# EAGLE schematic emonVS (EAGLE 9.6.2)
AUTHOR: OpenEnergyMonitor; IGNORE_RENUMBER: F;RV; SOURCE: github.com/openenergymonitor/emonVoltageSense; VERSION: 1.3.2
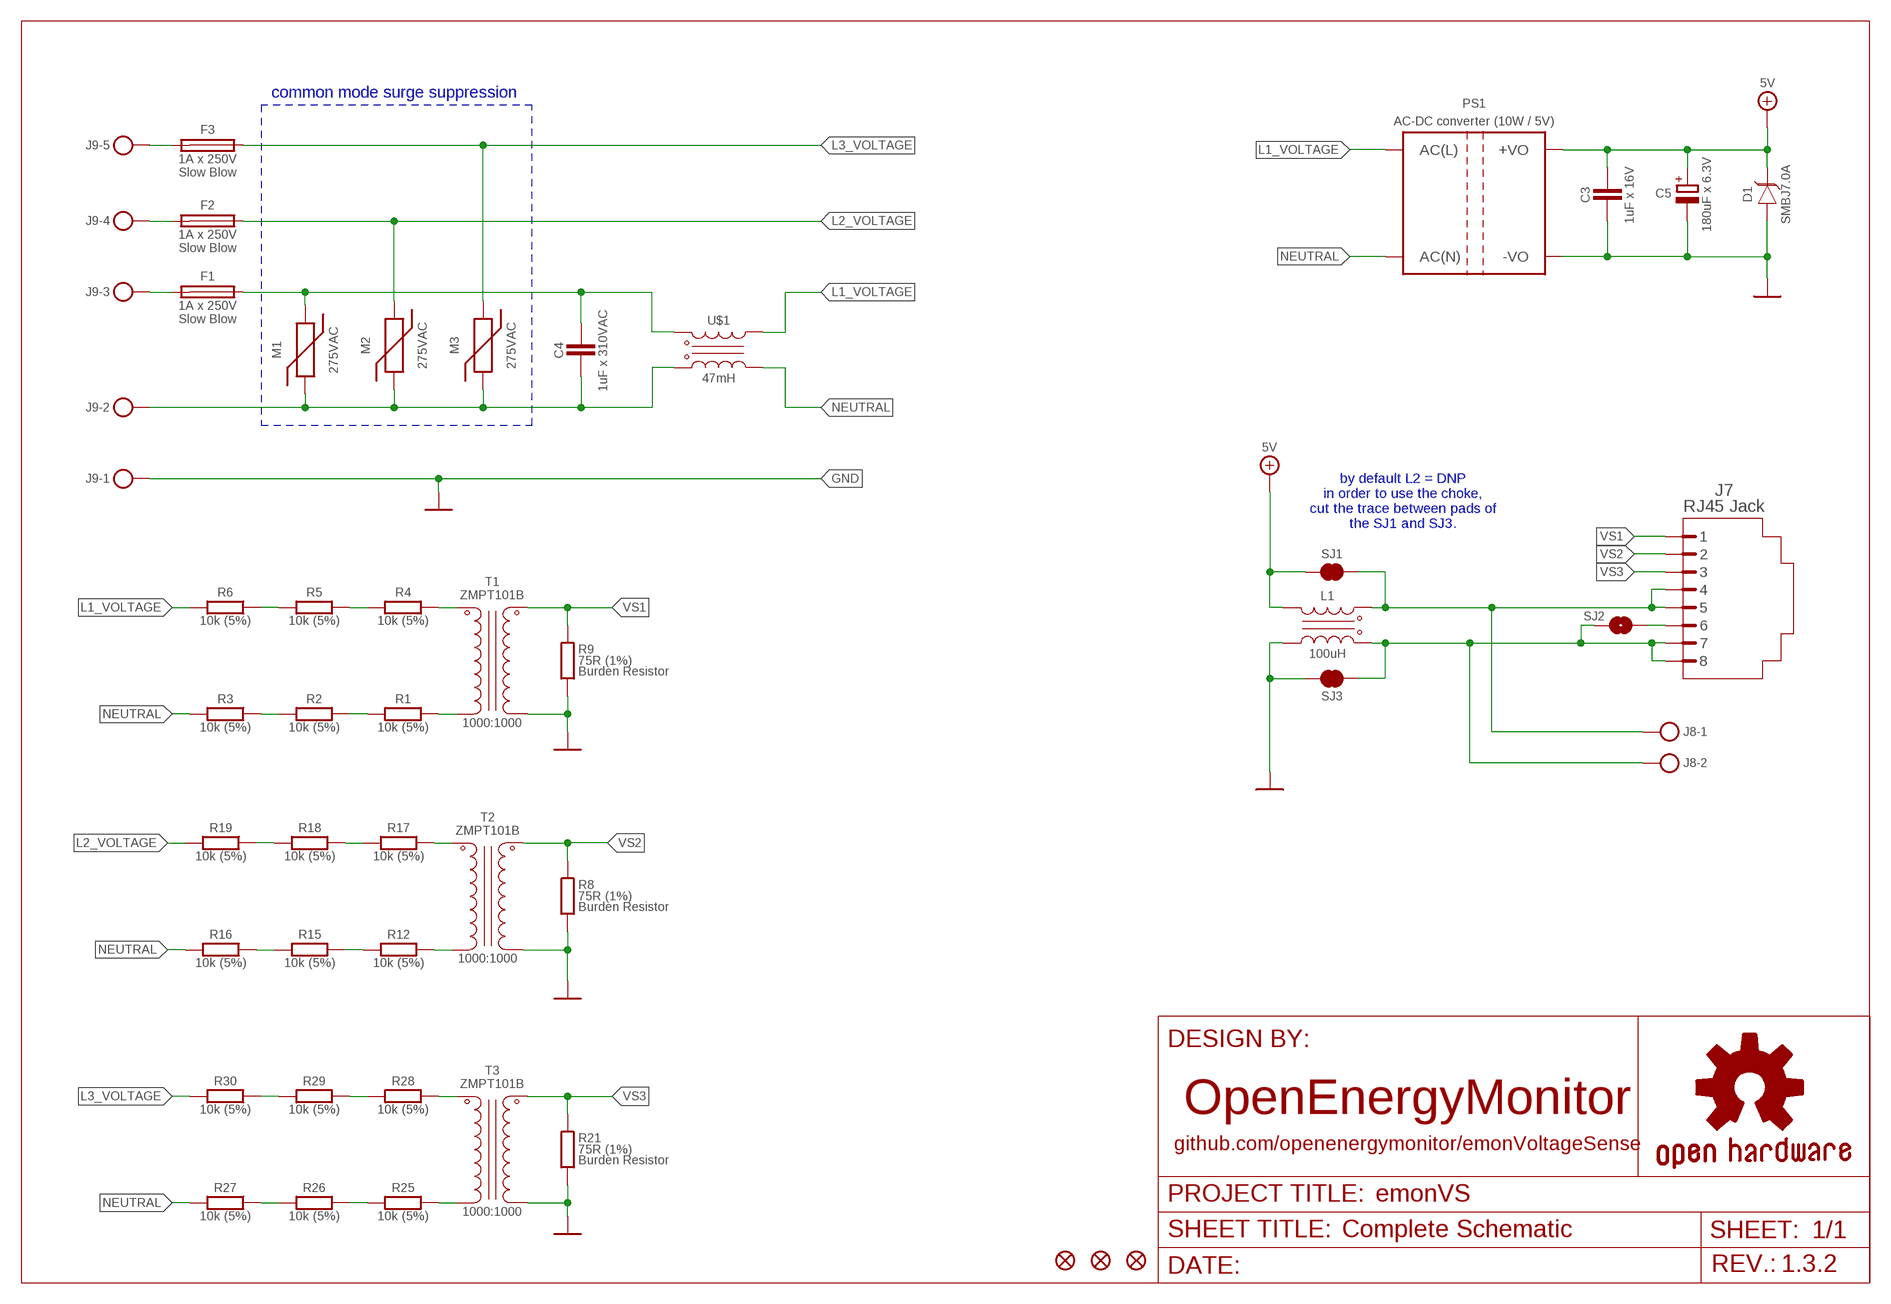
[diagram p0: schematic, sheet 1]

## Parts
C3  1uF x 16V  C_0603  [C0603]
C4  1uF x 310VAC  C_  [C_PTH]
C5  180uF x 6.3V  CP_SV-C  [CSV-C]
D1  TVS  [DO-214AA]
F1  1A x 250V  FUSE  [FUSE]
F2  1A x 250V  FUSE  [FUSE]
F3  1A x 250V  FUSE  [FUSE]
FD1  FIDUCIAL1X2  [FIDUCIAL]
FD2  FIDUCIAL1X2  [FIDUCIAL]
FD3  FIDUCIAL1X2  [FIDUCIAL]
J7  RJ45 Jack  RJ45-8PPTH  [RJ45-8P]
J8  TERMINAL_BLOCK_2P  [TERMINAL_BLOCK_2P]
J9  TERMINAL_BLOCK_5P  [TERMINAL_BLOCK_5P]
L1  100uH  CHOKES-WE-SL3  [CHOKE_WURTH]
M1  275VAC  MOV_14MM_275VAC  [MOV]
M2  275VAC  MOV_14MM_275VAC  [MOV]
M3  275VAC  MOV_14MM_275VAC  [MOV]
PS1  AC-DC converter (10W / 5V)  MULTICOMP-AC/DC  [MULTICOMP-AC/DC]
R1  10k (5%)  R_0603  [R0603]
R2  10k (5%)  R_0603  [R0603]
R3  10k (5%)  R_0603  [R0603]
R4  10k (5%)  R_0603  [R0603]
R5  10k (5%)  R_0603  [R0603]
R6  10k (5%)  R_0603  [R0603]
R8  75R (1%)  R_  [R_PTH_SMD]
R9  75R (1%)  R_  [R_PTH_SMD]
R12  10k (5%)  R_0603  [R0603]
R15  10k (5%)  R_0603  [R0603]
R16  10k (5%)  R_0603  [R0603]
R17  10k (5%)  R_0603  [R0603]
R18  10k (5%)  R_0603  [R0603]
R19  10k (5%)  R_0603  [R0603]
R21  75R (1%)  R_  [R_PTH_SMD]
R25  10k (5%)  R_0603  [R0603]
R26  10k (5%)  R_0603  [R0603]
R27  10k (5%)  R_0603  [R0603]
R28  10k (5%)  R_0603  [R0603]
R29  10k (5%)  R_0603  [R0603]
R30  10k (5%)  R_0603  [R0603]
SJ1  SOLDER_JUMPER_2P_NC  [SJ_2S-NC]
SJ2  SOLDER_JUMPER_2P_NO  [SJ_2S-NO]
SJ3  SOLDER_JUMPER_2P_NC  [SJ_2S-NC]
T1  ZMPT101B  [ZMPT101B]
T2  ZMPT101B  [ZMPT101B]
T3  ZMPT101B  [ZMPT101B]
U$1  47mH  CHOKES-SCHAFFNER-RN214+RN212  [CHOKE_SCHAFFNER]

## Nets
5.0V: C3.1 C5.+ D1.1(K) L1.6 PS1.+VO PS1.+VO_2(+VO) SJ1.1 ; supply symbol labelled 5V
5VF: J7.4 J7.5 J8.2 L1.1 SJ1.2
GND: C3.2 C5.- D1.2(A) J9.1 L1.4 PS1.-VO PS1.-VO_2(-VO) R8.1A R8.1B R9.1A R9.1B R21.1A R21.1B SJ3.1 T1.4(SEC_1) T2.4(SEC_1) T3.4(SEC_1) ; supply symbol labelled 0V
GNDF: J7.7 J7.8 J8.1 L1.3 SJ2.1 SJ3.2
L1_VOLTAGE: PS1.AC(L) PS1.AC(L)_2(AC(L)) R6.2 U$1.4A U$1.4B
L2_VOLTAGE: F2.OUT M2.1 R19.2
L3_VOLTAGE: F3.OUT M3.1 R30.2
N$1: R4.1 T1.2(PRI_1)
N$2: R1.1 T1.1(PRI_2)
N$3: R1.2 R2.1
N$4: R4.2 R5.1
N$5: R5.2 R6.1
N$6: R2.2 R3.1
N$7: F1.IN J9.3
N$8: F2.IN J9.4
N$9: J7.6 SJ2.2
N$10: R17.1 T2.2(PRI_1)
N$11: R12.1 T2.1(PRI_2)
N$12: R12.2 R15.1
N$13: R17.2 R18.1
N$14: R18.2 R19.1
N$15: R15.2 R16.1
N$16: F3.IN J9.5
N$18: R28.1 T3.2(PRI_1)
N$19: R25.1 T3.1(PRI_2)
N$21: R25.2 R26.1
N$22: R28.2 R29.1
N$23: R29.2 R30.1
N$24: R26.2 R27.1
N$28: C4.1A C4.1B J9.2 M1.2 M2.2 M3.2 U$1.1A U$1.1B
N$29: C4.2A C4.2B F1.OUT M1.1 U$1.2A U$1.2B
NEUTRAL: PS1.AC(N) PS1.AC(N)_2(AC(N)) R3.2 R16.2 R27.2 U$1.3A U$1.3B
VS1: J7.1 R9.2A R9.2B T1.3(SEC_2)
VS2: J7.2 R8.2A R8.2B T2.3(SEC_2)
VS3: J7.3 R21.2A R21.2B T3.3(SEC_2)

## Notes on the sheet
- common mode surge suppression
- by default L2 = DNP
  in order to use the choke,
  cut the trace between pads of
  the SJ1 and SJ3.

## Library data of the parts
C3 = My-RLC:C_: NON-POLARIZED CAP; PN: GCM188R71C105KA64D
C4 = OpenEnergyMonitor:C_: NON-POLARIZED CAP; PN: B32923C3105M000; PN1: B32923C3105M; PN2: DE2F3KY103MA3BM02F
C5 = My-RLC:CP_: POLARIZED CAP; PN: 6SVPE180M
D1 = My-Diodes:TVS; FAMILY: SMBJ7.0A; PN: SMBJ7.0A
F1-F3 = OpenEnergyMonitor:FUSE; FAMILY: Slow Blow; PN: MST 1A 250V
FD1-FD3 = OpenEnergyMonitor:FIDUCIAL: Fiducial Alignment Points Point-of-reference for pick-and-place machines and other optical instruments.
J7 = OpenEnergyMonitor:RJ45-8P: RJ45 Jack Simple RJ45, 8-pin connection - connector for common Cat5, Cat5e, and Cat6 Ethernet cables. Footprint not yet proven in production. Connector sku is PRT-00643; Breakout PCB sku is BOB-00716.; PN: PRT-00643
J8 = OpenEnergyMonitor:TERMINAL_BLOCK_2P: TE Connectivity - Fixed Terminal Blocks Number of Positions: 2 Position Pitch: 5 mm Connection Method: Screw Clamp Current Rating: 13.5 A Voltage Rating: 300 V Wire Gauge Min: 30 AWG Wire Gauge Max: 16 AWG; PN: 282836-2
J9 = OpenEnergyMonitor:TERMINAL_BLOCK_5P: TE Connectivity - Fixed Terminal Blocks Number of Positions: 5 Position Pitch: 5 mm Connection Method: Screw Clamp Current Rating: 13.5 A Voltage Rating: 300 V Wire Gauge Min: 30 AWG Wire Gauge Max: 16 AWG; PN: 282836-5
L1 = OpenEnergyMonitor:CHOKES: Schaffner Common Mode Chokes RN series Current-compensated Chokes; PN: 744252101
M1-M3 = OpenEnergyMonitor:MOV_: MOV - Metal-Oxide Varistor; PN: MOV-14D431KTR
PS1 = OpenEnergyMonitor:MULTICOMP-AC/DC: Multicomp PRO - AC to DC Converter Module This device supports 5W module (MP-LD05-23B05R2) (square footprint) and 10W module (MP-LD10-23B05R2) (rectangle footprint).; PN: MP-LD10-23B05R2
R1-R6 R12 R15-R19 R25-R30 = My-RLC:R_: RESISTOR; PN: ERJ-H3GJ103V
R8 R9 R21 = OpenEnergyMonitor:R_: Burden Resistors This footprint supports SMD 0603 package and PTH 0204 package.; DESCRIPTION: Burden Resistor; PN: ERJ-H3EF75R0V
SJ1 SJ3 = OpenEnergyMonitor:SOLDER_JUMPER_2P_NC: Solder Jumper Standard SMD solder jumper. Used to automate production. Two varients : Normally Open and Normally Closed are the same, but have different paste layers. NC will have a large amount of paste and should jumper during reflow.
SJ2 = OpenEnergyMonitor:SOLDER_JUMPER_2P_NO: Solder Jumper Standard SMD solder jumper. Used to automate production. Two varients : Normally Open and Normally Closed are the same, but have different paste layers. NC will have a large amount of paste and should jumper during reflow.
T1-T3 = OpenEnergyMonitor:ZMPT101B: Current-type Voltage Transformer Source: Datasheet; PN: ZMPT101B; RATIO: 1000:1000
U$1 = OpenEnergyMonitor:CHOKES: Schaffner Common Mode Chokes RN series Current-compensated Chokes; PN: RN214-0.3-02-47M

## Net classes
0 default: clearance 0.205 mm
1 power: width 0.305 mm, drill 0.6 mm, clearance 0.254 mm
2 gnd: width 0.254 mm, drill 0.6 mm, clearance 0.254 mm